# EAGLE design 14sbms_sch (EAGLE 6.1)
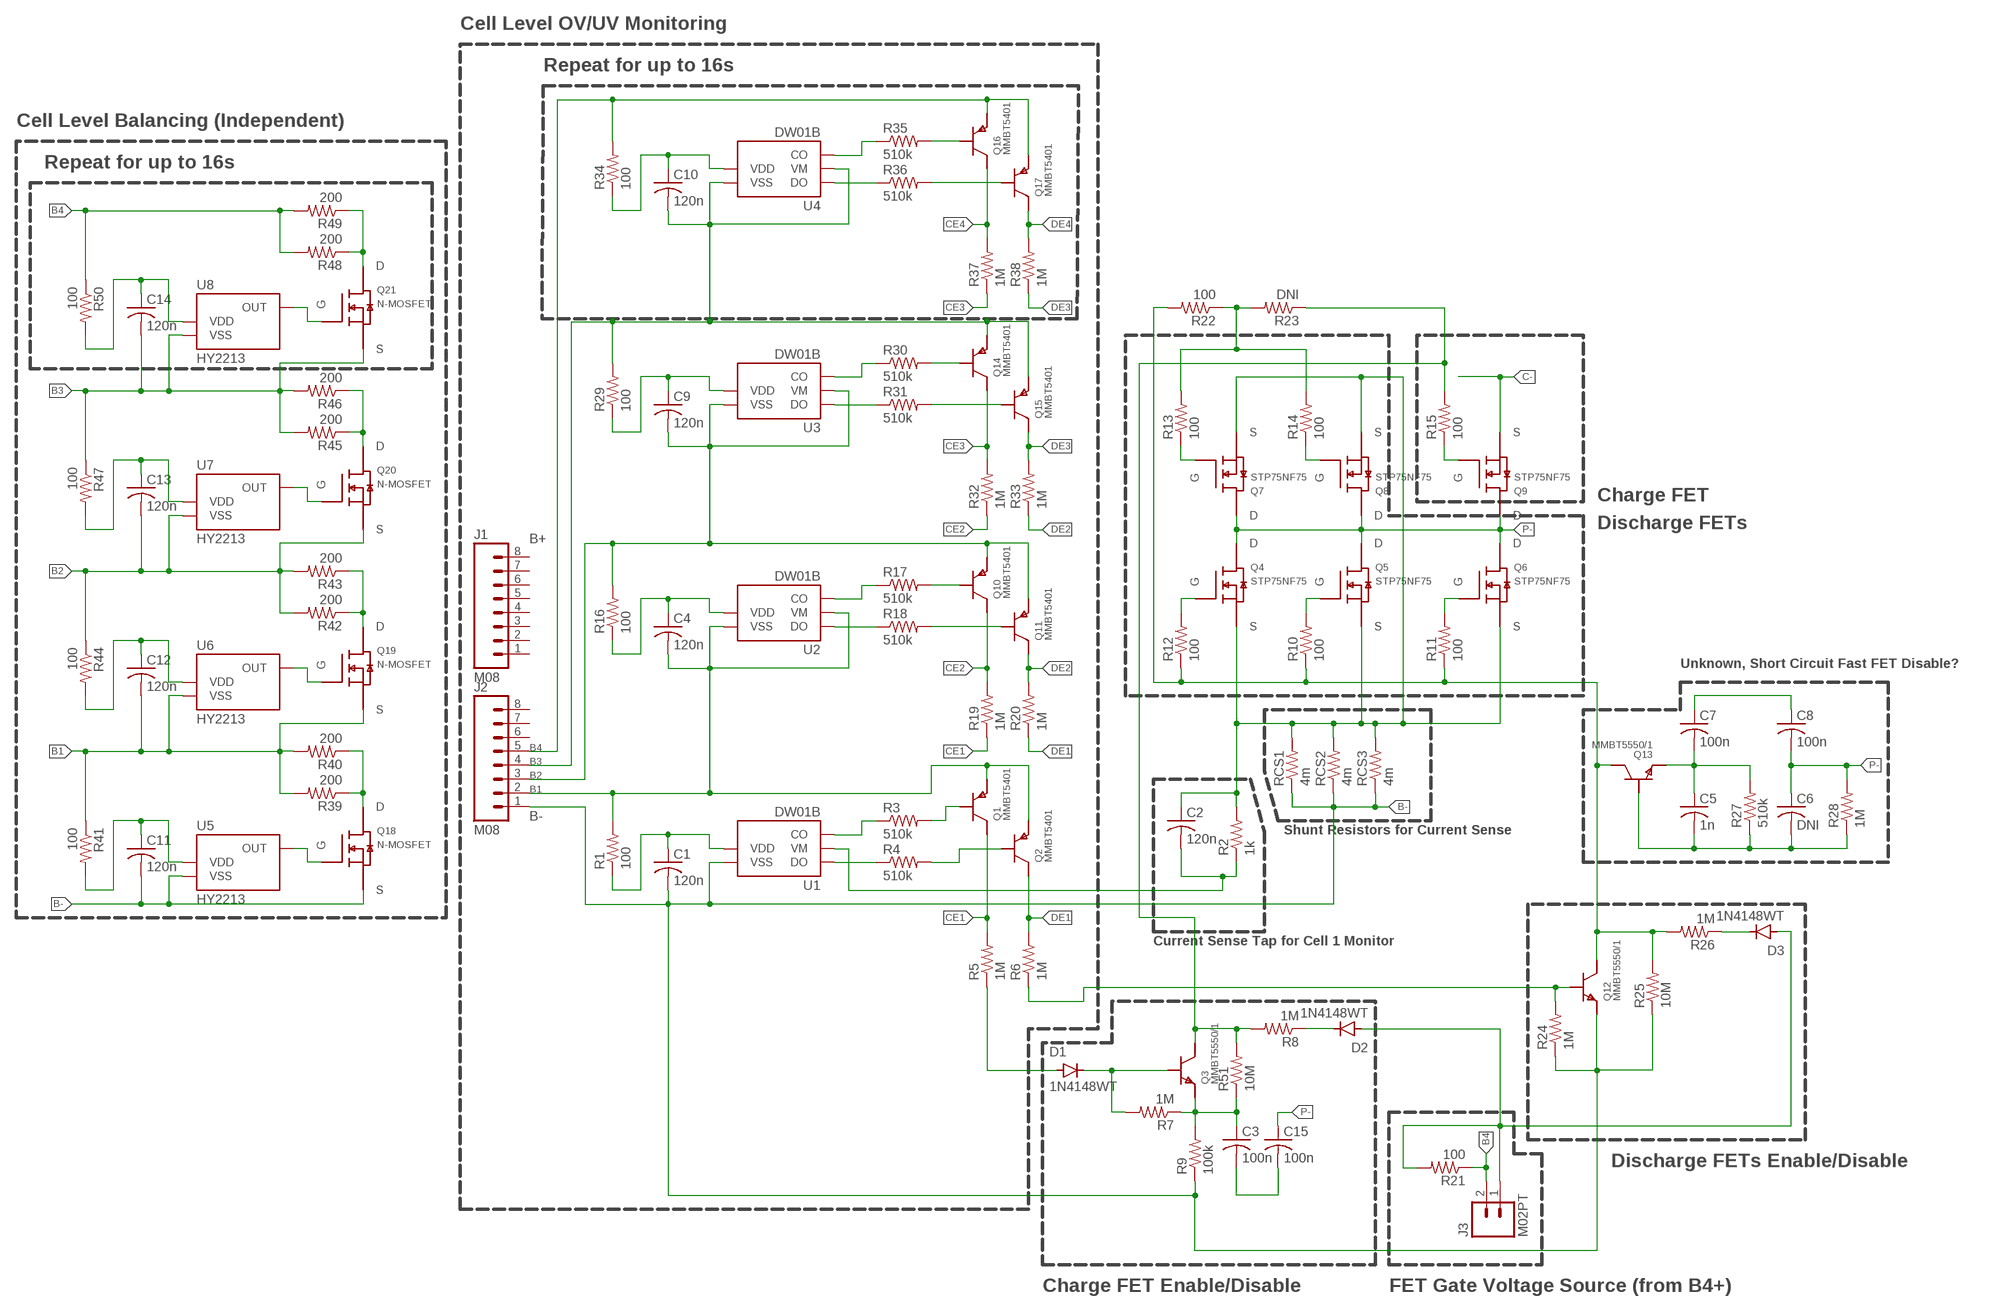
[diagram p0: schematic, sheet 1]

## Parts
C1  120n  C-USC0603  [C0603]
C2  120n  C-USC0603  [C0603]
C3  100n  C-USC0603  [C0603]
C4  120n  C-USC0603  [C0603]
C5  1n  C-USC0603  [C0603]
C6  DNI  C-USC0603  [C0603]
C7  100n  C-USC0805  [C0805]
C8  100n  C-USC0805  [C0805]
C9  120n  C-USC0603  [C0603]
C10  120n  C-USC0603  [C0603]
C11  120n  C-USC0603  [C0603]
C12  120n  C-USC0603  [C0603]
C13  120n  C-USC0603  [C0603]
C14  120n  C-USC0603  [C0603]
C15  100n  C-USC0603  [C0603]
D1  1N4148WT  [SOD523]
D2  1N4148WT  [SOD523]
D3  1N4148WT  [SOD523]
J1  M08  [S8B-XH-A]
J2  M08  [S8B-XH-A]
J3  M02PT  [PHOENIXCONTACT1935161]
Q1  MMBT5401  [SOT23]
Q2  MMBT5401  [SOT23]
Q3  MMBT5550/1  [SOT23]
Q4  STP75NF75  [D2PAK-ST]
Q5  STP75NF75  [D2PAK-ST]
Q6  STP75NF75  [D2PAK-ST]
Q7  STP75NF75  [D2PAK-ST]
Q8  STP75NF75  [D2PAK-ST]
Q9  STP75NF75  [D2PAK-ST]
Q10  MMBT5401  [SOT23]
Q11  MMBT5401  [SOT23]
Q12  MMBT5550/1  [SOT23]
Q13  MMBT5550/1  [SOT23]
Q14  MMBT5401  [SOT23]
Q15  MMBT5401  [SOT23]
Q16  MMBT5401  [SOT23]
Q17  MMBT5401  [SOT23]
Q18  N-MOSFET  [SOT23]
Q19  N-MOSFET  [SOT23]
Q20  N-MOSFET  [SOT23]
Q21  N-MOSFET  [SOT23]
R1  100  R-US_R0603  [R0603]
R2  1k  R-US_R0603  [R0603]
R3  510k  R-US_R0603  [R0603]
R4  510k  R-US_R0603  [R0603]
R5  1M  R-US_R0603  [R0603]
R6  1M  R-US_R0603  [R0603]
R7  1M  R-US_R0603  [R0603]
R8  1M  R-US_R0603  [R0603]
R9  100k  R-US_R0603  [R0603]
R10  100  R-US_R0603  [R0603]
R11  100  R-US_R0603  [R0603]
R12  100  R-US_R0603  [R0603]
R13  100  R-US_R0603  [R0603]
R14  100  R-US_R0603  [R0603]
R15  100  R-US_R0603  [R0603]
R16  100  R-US_R0603  [R0603]
R17  510k  R-US_R0603  [R0603]
R18  510k  R-US_R0603  [R0603]
R19  1M  R-US_R0603  [R0603]
R20  1M  R-US_R0603  [R0603]
R21  100  R-US_R0603  [R0603]
R22  100  R-US_R0603  [R0603]
R23  DNI  R-US_R0603  [R0603]
R24  1M  R-US_R0603  [R0603]
R25  10M  R-US_R0603  [R0603]
R26  1M  R-US_R0603  [R0603]
R27  510k  R-US_R0603  [R0603]
R28  1M  R-US_R0603  [R0603]
R29  100  R-US_R0603  [R0603]
R30  510k  R-US_R0603  [R0603]
R31  510k  R-US_R0603  [R0603]
R32  1M  R-US_R0603  [R0603]
R33  1M  R-US_R0603  [R0603]
R34  100  R-US_R0603  [R0603]
R35  510k  R-US_R0603  [R0603]
R36  510k  R-US_R0603  [R0603]
R37  1M  R-US_R0603  [R0603]
R38  1M  R-US_R0603  [R0603]
R39  200  R-US_R1206  [R1206]
R40  200  R-US_R1206  [R1206]
R41  100  R-US_R0603  [R0603]
R42  200  R-US_R1206  [R1206]
R43  200  R-US_R1206  [R1206]
R44  100  R-US_R0603  [R0603]
R45  200  R-US_R1206  [R1206]
R46  200  R-US_R1206  [R1206]
R47  100  R-US_R0603  [R0603]
R48  200  R-US_R1206  [R1206]
R49  200  R-US_R1206  [R1206]
R50  100  R-US_R0603  [R0603]
R51  10M  R-US_R0603  [R0603]
RCS1  4m  R-US_R2512  [R2512]
RCS2  4m  R-US_R2512  [R2512]
RCS3  4m  R-US_R2512  [R2512]
U1  DW01B  [SOT23-6]
U2  DW01B  [SOT23-6]
U3  DW01B  [SOT23-6]
U4  DW01B  [SOT23-6]
U5  HY2213  [SOT23-6]
U6  HY2213  [SOT23-6]
U7  HY2213  [SOT23-6]
U8  HY2213  [SOT23-6]

## Nets
B1: C4.2 C12.2 J2.2 Q1.2(E) Q2.2(E) Q19.2(S) R1.2 R39.2 R40.2 R41.1 U2.2(VM) U2.6(VSS) U6.3(VSS)
B2: C9.2 C13.2 J2.3 Q10.2(E) Q11.2(E) Q20.2(S) R16.2 R42.2 R43.2 R44.1 U3.2(VM) U3.6(VSS) U7.3(VSS)
B3: C10.2 C14.2 J2.4 Q14.2(E) Q15.2(E) Q21.2(S) R29.2 R45.2 R46.2 R47.1 U4.2(VM) U4.6(VSS) U8.3(VSS)
B4: J2.5 J3.2 Q16.2(E) Q17.2(E) R21.1 R34.2 R48.2 R49.2 R50.1
B-: C1.2 C11.2 J2.1 Q12.2(E) Q18.2(S) R9.1 R24.1 R25.1 RCS1.1 RCS2.1 RCS3.1 U1.6(VSS) U5.3(VSS)
BALG1: Q18.1(G) U5.6(OUT)
BALG2: Q19.1(G) U6.6(OUT)
BALG3: Q20.1(G) U7.6(OUT)
BALG4: Q21.1(G) U8.6(OUT)
C-: Q9.3-S(S)
CE1: Q1.3(C) R5.2 R19.1
CE2: Q10.3(C) R19.2 R32.1
CE3: Q14.3(C) R32.2 R37.1
CE4: Q16.3(C) R37.2
DE1: Q2.3(C) R6.2 R20.1
DE2: Q11.3(C) R20.2 R33.1
DE3: Q15.3(C) R33.2 R38.1
DE4: Q17.3(C) R38.2
GS+: D2.A(ANODE) D3.A(ANODE) J3.1 R21.2
N$1: R4.1 U1.1(DO)
N$2: C1.1 R1.1 U1.5(VDD)
N$3: Q3.3(C) R8.2 R15.2 R23.1 R51.2
N$4: C2.2 R2.1 U1.2(VM)
N$5: Q7.1-G(G) R13.1
N$6: R3.1 U1.3(CO)
N$7: Q1.1(B) R3.2
N$8: Q2.1(B) R4.2
N$9: C3.1 Q3.2(E) R7.1 R9.2 R51.1
N$10: D1.A(ANODE) R5.1
N$11: D1.K(CATHODE) Q3.1(B) R7.2
N$12: D2.K(CATHODE) R8.1
N$13: Q8.1-G(G) R14.1
N$14: Q9.1-G(G) R15.1
N$15: Q6.1-G(G) R11.2
N$16: Q5.1-G(G) R10.2
N$17: Q4.1-G(G) R12.2
N$18: R13.2 R14.2 R22.1 R23.2
N$19: Q12.3(C) Q13.3(C) R10.1 R11.1 R12.1 R22.2 R25.2 R26.2
N$20: Q17.1(B) R36.2
N$21: Q16.1(B) R35.2
N$22: Q11.1(B) R18.2
N$23: Q10.1(B) R17.2
N$24: R17.1 U2.3(CO)
N$25: R18.1 U2.1(DO)
N$26: C7.1 C8.1
N$27: Q12.1(B) R6.1 R24.2
N$28: C4.1 R16.1 U2.5(VDD)
N$29: C5.1 C7.2 Q13.2(E) R27.2
N$30: R35.1 U4.3(CO)
N$31: D3.K(CATHODE) R26.1
N$32: C5.2 C6.2 Q13.1(B) R27.1 R28.1
N$33: R36.1 U4.1(DO)
N$34: Q15.1(B) R31.2
N$35: Q14.1(B) R30.2
N$36: R30.1 U3.3(CO)
N$37: R31.1 U3.1(DO)
N$38: C9.1 R29.1 U3.5(VDD)
N$39: C10.1 R34.1 U4.5(VDD)
N$40: C11.1 R41.2 U5.2(VDD)
N$41: Q18.3(D) R39.1 R40.1
N$42: C12.1 R44.2 U6.2(VDD)
N$43: Q19.3(D) R42.1 R43.1
N$44: C13.1 R47.2 U7.2(VDD)
N$45: Q20.3(D) R45.1 R46.1
N$46: C14.1 R50.2 U8.2(VDD)
N$47: Q21.3(D) R48.1 R49.1
N$49: C3.2 C15.2
P-: C6.1 C8.2 C15.1 Q4.2-D(D) Q5.2-D(D) Q6.2-D(D) Q7.2-D(D) Q8.2-D(D) Q9.2-D(D) R28.2
S: C2.1 Q4.3-S(S) Q5.3-S(S) Q6.3-S(S) Q7.3-S(S) Q8.3-S(S) R2.2 RCS1.2 RCS2.2 RCS3.2
Unconnected: J1.1 J1.2 J1.3 J1.4 J1.5 J1.6 J1.7 J1.8 J2.6 J2.7 J2.8

## Notes on the sheet
- Cell Level OV/UV Monitoring
- Repeat for up to 16s
- Cell Level Balancing (Independent)
- Repeat for up to 16s
- Charge FET
- Discharge FETs
- B+
- Unknown, Short Circuit Fast FET Disable?
- B-
- Shunt Resistors for Current Sense
- Current Sense Tap for Cell 1 Monitor
- Discharge FETs Enable/Disable
- Charge FET Enable/Disable | FET Gate Voltage Source (from B4+)

## Library data of the parts
C1-C15 = resistor:C-US: CAPACITOR, American symbol
D1-D3 = custom:1N4148WT: Standard Diode 150mA 75V Vf 1.25V @150mA, 0.855 @10mA, Ir 1.0uA @Vr=75V, 2.0pF, Trr = 4.0ns
J1 J2 = custom:M08
J3 = custom:M02
Q1 Q2 Q10 Q11 Q14-Q17 = custom:MMBT5401: PNP BJT 150V 500mA 250mW 2L Mark Code
Q3 Q12 Q13 = custom:MMBT5550/1: NPN BJT 140V (5550, M1F Mark Code)/160V (5551, G1 Mark Code) 600mA 225mW
Q4-Q9 = custom:STP75NF75: N-channel MOSFET 75V 11mOhm 80A
Q18-Q21 = custom:N-MOSFET: N-Channel MOSFET - HM2302A, Vds 20V, Id 2.9A, Rdson 59mOhm @2.5Vgs, Marking Code = A2SHB
R1-R51 RCS1-RCS3 = resistor:R-US_: RESISTOR, American symbol
U1-U4 = custom:DW01B: 1-Cell Lithium-Ion/Polymer Battery Pack Protection Controller IC Precision Overcharge Protection Voltage (4.30V ± 50mV) Over-discharge Protection voltage between (2.50V ± 75mV) Over-current Protection voltage between (0.15V ± 20mV)
U5-U8 = custom:HY2213: 1 Cell Li-ion/Polymer Battery Charge Balance IC HY2213-AB3B Voc 4.200±0.025V Voc-r 4.200-0.035V,4.200+0.025V P-FET ctrl HY2213-BB3A Voc 4.200±0.025V Voc-r 4.190±0.035V N-FET ctrl HY2213-CB3A Voc 4.180±0.025V Voc-r 4.180-0.035V,4.180+0.025V N-FET ctrl

## Board
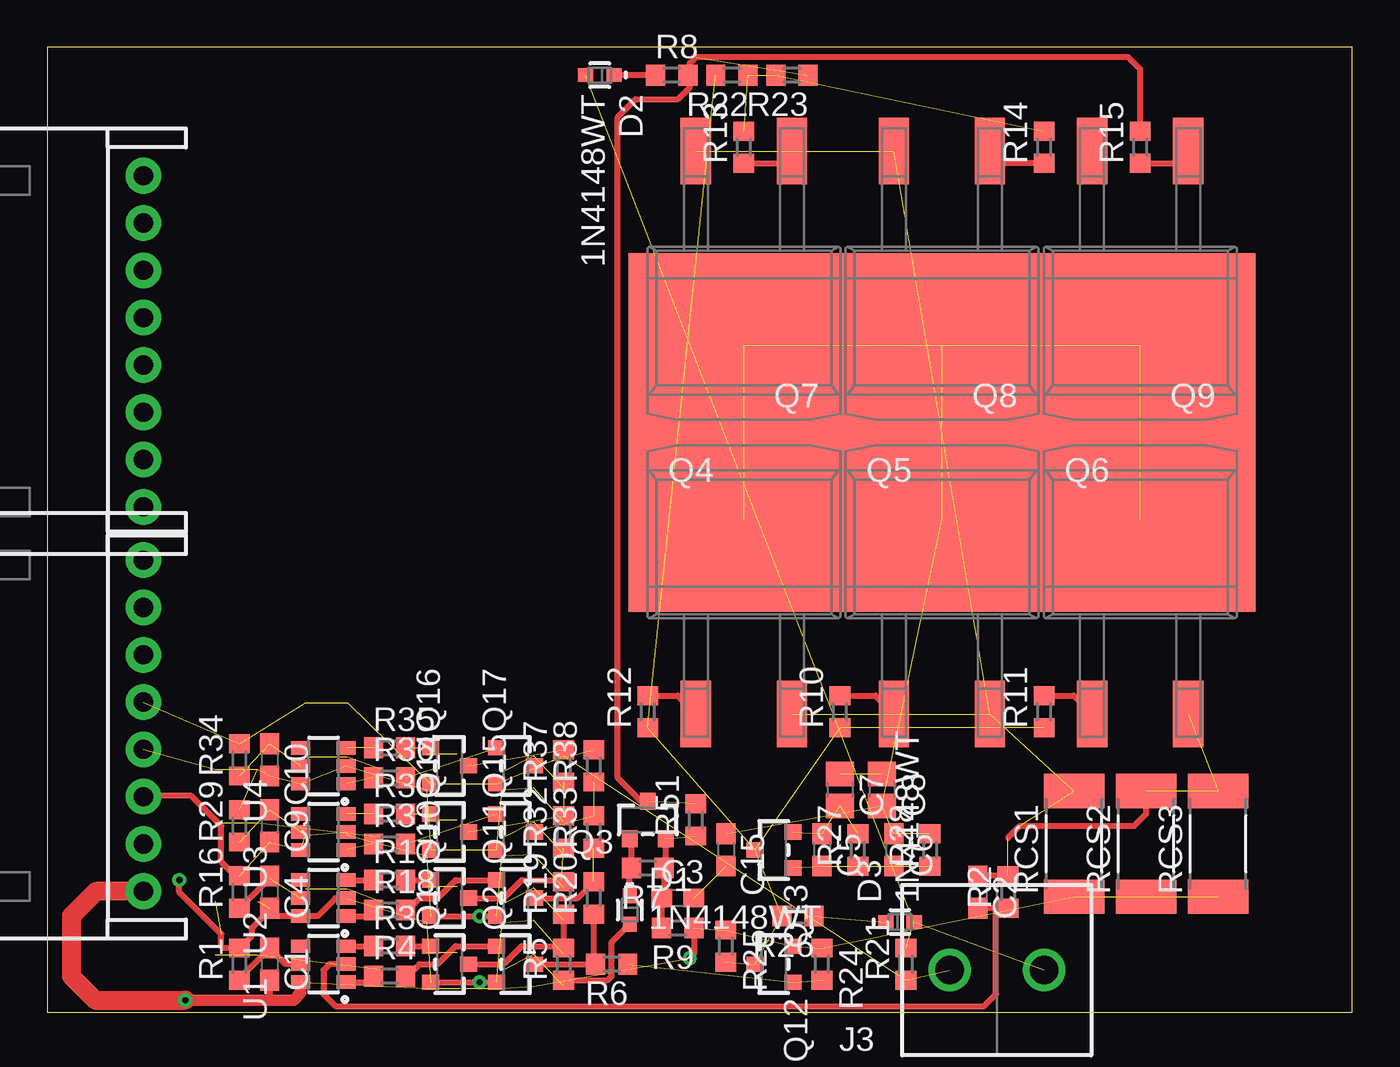
[diagram p1: board, top side]
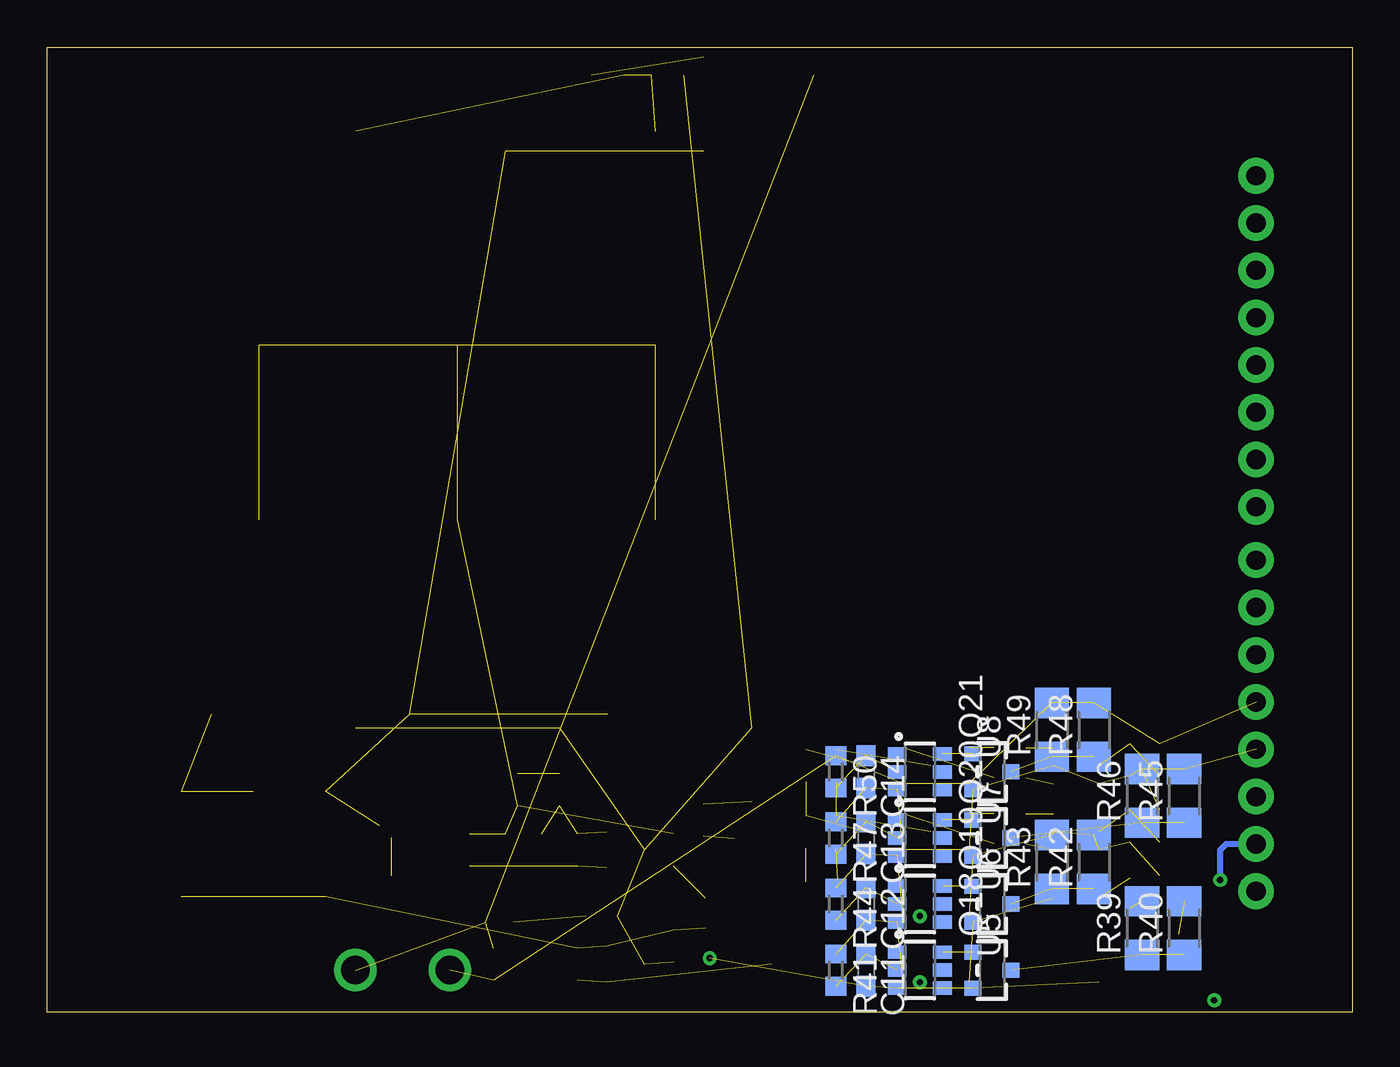
[diagram p2: board, bottom side, seen from below]

Size 69 x 51 mm. Coordinates in mm from the lower left corner, seen from the top.
Outline: 0,0 69,0 69,51 0,51 0,0
Copper layers (1*16): Top 0.035mm / dielectric 1.5mm / Bottom 0.035mm
Design rules: minimum track width 10mil, minimum drill 0.6mm, track to track 8mil, track to pad 8mil, pad to pad 8mil, via to via 8mil, smd to smd 8mil, copper to edge 40mil, drill to drill 8mil, minimum pad ring 10mil, minimum via ring 8mil, stop-mask expansion 4mil, vias tented up to drill 0mil, thermal gap 10mil

### Footprints (pad centres in the part's own frame; a part is rotated, then mirrored left to right if it is on the bottom)
C0603 = smd 1.1 x 1: 1 -0.85,0; 2 0.85,0
C0805 = smd 1.3 x 1.5: 1 -0.85,0; 2 0.85,0
SOD523 = smd 0.7 x 0.8: A 0,-0.75; K 0,0.75
S8B-XH-A = drill 1.016 pad 1.88: 1 -2.5,0; 2 0,0; 3 2.5,0; 4 5,0; 5 7.5,0; 6 10,0; 7 12.5,0; 8 15,0
PHOENIXCONTACT1935161 = drill 1.5: 1 0,0; 2 5,0
SOT23 = smd 0.8 x 0.9: 1 0.95,1; 2 -0.95,1; 3 0,-1
D2PAK-ST = smd 1.6 x 3.5: 1-G -2.54,-10.275; 3-S 2.54,-10.275 | smd 12.2 x 9.75: 2-D 0,0
R0603 = smd 1 x 1.1: 1 -0.85,0; 2 0.85,0
R1206 = smd 1.6 x 1.803: 1 -1.422,0; 2 1.422,0
R2512 = smd 1.8 x 3.2: 1 -2.8,0; 2 2.8,0
SOT23-6 = smd 0.7 x 1: 1 -0.95,-1.2; 2 0,-1.2; 3 0.95,-1.2; 4 0.95,1.2; 5 0,1.2; 6 -0.95,1.2

### Placement (x,y rotation side)
C1  11.75,2.54 270 top
C2  49.21,6.35 270 top
C3  33.34,6.03 0 top
C4  11.75,6.35 270 top
C5  40.96,8.57 270 top
C6  44.77,8.57 270 top
C7  41.91,11.75 270 top
C8  44.13,11.75 270 top
C9  11.75,9.84 270 top
C10  11.75,13.34 270 top
C11  25.72,2.22 270 bottom
C12  25.72,5.71 270 bottom
C13  25.72,9.21 270 bottom
C14  25.72,12.7 270 bottom
C15  35.88,8.57 270 top
D1  30.8,5.4 0 top
D2  29.21,49.53 270 top
D3  45.09,4.76 90 top
J1  5.08,29.21 90 top
J2  5.08,8.89 90 top
J3  52.7,2.22 180 top
Q1  21.27,2.54 90 top
Q2  24.77,2.54 90 top
Q3  31.75,10.16 180 top
Q4  36.83,26.04 0 top
Q5  47.31,26.04 0 top
Q6  57.78,26.04 0 top
Q7  36.83,35.24 180 top
Q8  47.31,35.24 180 top
Q9  57.78,35.24 180 top
Q10  21.27,6.03 90 top
Q11  24.77,6.03 90 top
Q12  38.42,2.54 270 top
Q13  38.42,8.57 270 top
Q14  21.27,9.53 90 top
Q15  24.77,9.53 90 top
Q16  21.27,13.02 90 top
Q17  24.77,13.02 90 top
Q18  19.05,2.22 90 bottom
Q19  19.05,5.71 90 bottom
Q20  19.05,9.21 90 bottom
Q21  19.05,12.7 90 bottom
R1  10.16,2.54 90 top
R2  50.8,6.35 90 top
R3  18.1,3.49 0 top
R4  18.1,1.91 0 top
R5  27.3,2.54 90 top
R6  29.84,2.54 180 top
R7  31.75,7.62 180 top
R8  33.02,49.53 0 top
R9  33.34,4.45 180 top
R10  41.91,15.88 90 top
R11  52.7,15.88 90 top
R12  31.75,15.88 90 top
R13  36.83,45.72 90 top
R14  52.7,45.72 90 top
R15  57.78,45.72 90 top
R16  10.16,6.35 90 top
R17  18.1,6.99 0 top
R18  18.1,5.4 0 top
R19  27.3,6.03 90 top
R20  28.89,6.03 90 top
R21  45.4,2.54 90 top
R22  36.2,49.53 180 top
R23  39.37,49.53 180 top
R24  40.96,2.54 270 top
R25  35.88,3.49 270 top
R26  39.69,5.08 180 top
R27  42.86,8.57 90 top
R28  46.67,8.57 90 top
R29  10.16,9.84 90 top
R30  18.1,10.48 0 top
R31  18.1,8.89 0 top
R32  27.3,9.53 90 top
R33  28.89,9.53 90 top
R34  10.16,13.34 90 top
R35  18.1,13.97 0 top
R36  18.1,12.38 0 top
R37  27.3,13.02 90 top
R38  28.89,13.02 90 top
R39  11.11,4.45 90 bottom
R40  8.89,4.45 90 bottom
R41  27.3,2.22 270 bottom
R42  13.65,7.94 90 bottom
R43  15.88,7.94 90 bottom
R44  27.3,5.71 270 bottom
R45  8.89,11.43 90 bottom
R46  11.11,11.43 90 bottom
R47  27.3,9.21 270 bottom
R48  13.65,14.92 90 bottom
R49  15.88,14.92 90 bottom
R50  27.3,12.7 270 bottom
R51  34.29,10.16 90 top
RCS1  54.29,8.89 90 top
RCS2  58.1,8.89 90 top
RCS3  61.91,8.89 90 top
U1  14.61,2.54 90 top
U2  14.61,6.03 90 top
U3  14.61,9.53 90 top
U4  14.61,13.02 90 top
U5  22.86,2.22 270 bottom
U6  22.86,5.71 270 bottom
U7  22.86,9.21 270 bottom
U8  22.86,12.7 270 bottom

### Tracks (layer width: path | path; a pad name or v marks a point on that pad's centre or on a via)
B1  (via drill 0.33)  (7 unrouted)
  Top 0.305: v6.99,6.99 6.99,6.35 9.21,4.13 9.21,3.49 9.31,3.39 R1.2 10.79,4.03 10.79,4.45 11.43,5.08 | Q2.2 Q1.2 22.54,1.59 v22.86,1.59 | 11.43,5.08 U2.6 14.29,5.08 15.24,6.03 U2.2 | C4.2 11.43,5.08
  Bottom 0.305: v6.99,6.99 6.99,8.57 6.67,8.89 J2.2
B2  (via drill 0.33)  (10 unrouted)
  Top 0.305: R16.2 9.95,7.2 9.21,7.94 9.21,9.84 7.62,11.43 5.12,11.43 J2.3 | Q11.2 Q10.2 v22.86,5.08
B3  (12 unrouted)
B4  (8 unrouted)
B-  (via drill 0.33)  (10 unrouted)
  Top 0.305: C1.2 11.75,0.95 11.43,0.64 | R9.1 34.19,3.07 v33.97,2.86
  Top 0.61: v7.3,0.64 11.43,0.64 13.02,0.64 13.4,1.02 U1.6
  Top 1.016: J2.1 2.58,6.39 1.27,5.08 1.27,1.91 2.54,0.64 v7.3,0.64
BALG1  (1 unrouted)
BALG2  (1 unrouted)
BALG3  (1 unrouted)
BALG4  (1 unrouted)
CE1
  Top 0.305: Q1.3 24.13,2.54 25.08,3.49 27.3,3.49 R5.2 R19.1
CE2  (1 unrouted)
  Top 0.305: Q10.3 24.13,6.03 25.08,6.99 27.2,6.99 R19.2
CE3  (2 unrouted)
CE4  (1 unrouted)
DE1
  Top 0.305: R20.1 28.89,2.64 R6.2 Q2.3
DE2  (1 unrouted)
  Top 0.305: Q11.3 28.04,6.03 R20.2
DE3  (2 unrouted)
DE4  (1 unrouted)
GS+  (3 unrouted)
N$1
  Top 0.305: U1.1 16.93,1.59 R4.1
N$2
  Top 0.305: R1.1 10.16,1.8 C1.1 12.6,2.54 U1.5
N$3  (2 unrouted)
  Top 0.305: Q3.3 31.39,11.16 30.16,12.38 30.16,47.31 31.11,48.26 33.34,48.26 33.97,48.9 33.97,49.43 | 33.97,49.43 R8.2 | R15.2 57.78,49.85 57.15,50.48 34.29,50.48 33.97,50.16 33.97,49.43
N$4
  Top 0.305: U1.2 14.92,2.54 14.61,2.22 14.61,0.95 15.24,0.32 49.53,0.32 50.16,0.95 50.16,5.5 | R2.1 50.16,5.5 | 50.16,5.5 C2.2
N$5
  Top 0.305: R13.1 39.04,44.87 Q7.1-G
N$6
  Top 0.305: U1.3 R3.1
N$7
  Top 0.305: R3.2 Q1.1
N$8
  Top 0.305: R4.2 19.05,1.91 19.68,2.54 20.64,2.54 21.59,3.49 Q2.1
N$9  (1 unrouted)
  Top 0.305: Q3.2 32.7,7.72 R7.1 32.6,6.14 C3.1 R9.2
N$10
  Top 0.305: R5.1 29.63,1.69 29.84,1.91 29.84,3.69 D1.A
N$11
  Top 0.305: D1.K 30.8,7.52 R7.2 30.9,9.06 Q3.1
N$12
  Top 0.305: R8.1 D2.K
N$13
  Top 0.305: R14.1 50.49,44.87 Q8.1-G
N$14
  Top 0.305: R15.1 60.02,44.87 Q9.1-G
N$15
  Top 0.305: R11.2 54.28,16.73 Q6.1-G
N$16
  Top 0.305: R10.2 43.8,16.73 Q5.1-G
N$17
  Top 0.305: R12.2 33.33,16.73 Q4.1-G
N$18  (3 unrouted)
N$19  (7 unrouted)
N$20  (1 unrouted)
N$21  (1 unrouted)
N$22
  Top 0.305: R18.2 19.05,5.4 19.68,6.03 20.64,6.03 21.59,6.99 Q11.1
N$23
  Top 0.305: R17.2 Q10.1
N$24
  Top 0.305: U2.3 R17.1
N$25
  Top 0.305: U2.1 16.93,5.08 R18.1
N$26  (1 unrouted)
N$27  (2 unrouted)
N$28  (1 unrouted)
  Top 0.305: C4.1 11.75,7.09 R16.1
N$29  (3 unrouted)
N$30  (1 unrouted)
N$31  (1 unrouted)
N$32  (4 unrouted)
N$33  (1 unrouted)
N$34  (1 unrouted)
N$35  (1 unrouted)
N$36  (1 unrouted)
N$37  (1 unrouted)
N$38  (2 unrouted)
N$39  (2 unrouted)
N$40  (2 unrouted)
N$41  (2 unrouted)
N$42  (2 unrouted)
N$43  (2 unrouted)
N$44  (2 unrouted)
N$45  (2 unrouted)
N$46  (2 unrouted)
N$47  (2 unrouted)
N$49  (1 unrouted)
P-  (9 unrouted)
S  (8 unrouted)
  Top 0.305: 50.8,9.21 51.44,9.84 57.47,9.84 58.1,10.48 RCS2.2 | R2.2 C2.1